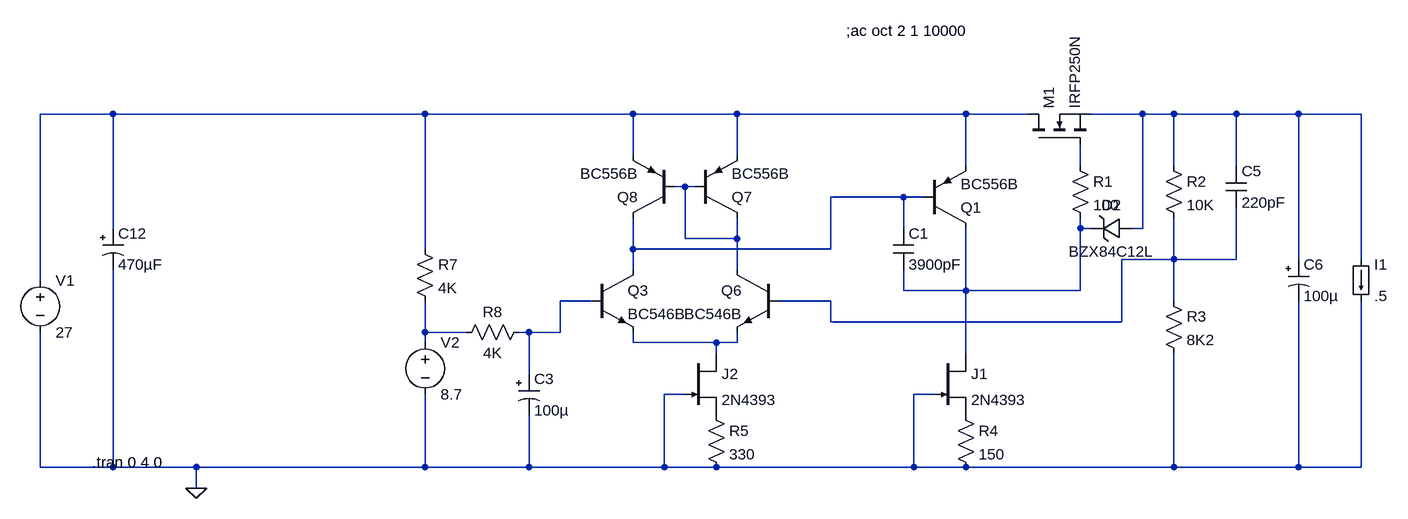
[diagram p0: schematic Sigma11-1.asc]
Sigma11-1.asc, the LTspice schematic file:
Version 4
SHEET 1 1752 1332
WIRE -272 112 -384 112
WIRE 208 112 -272 112
WIRE 528 112 208 112
WIRE 688 112 528 112
WIRE 1040 112 688 112
WIRE 1136 112 1040 112
WIRE 1312 112 1232 112
WIRE 1360 112 1312 112
WIRE 1456 112 1360 112
WIRE 1552 112 1456 112
WIRE 1648 112 1552 112
WIRE 528 176 528 112
WIRE 688 176 688 112
WIRE 1040 192 1040 112
WIRE 1216 192 1216 160
WIRE 1360 192 1360 112
WIRE 1456 192 1456 112
WIRE 608 224 592 224
WIRE 624 224 608 224
WIRE 944 240 832 240
WIRE 976 240 944 240
WIRE -272 288 -272 112
WIRE 944 288 944 240
WIRE 1216 288 1216 272
WIRE 1232 288 1216 288
WIRE 1312 288 1312 112
WIRE 1312 288 1296 288
WIRE 608 304 608 224
WIRE 688 304 688 272
WIRE 688 304 608 304
WIRE 208 320 208 112
WIRE 528 320 528 272
WIRE 832 320 832 240
WIRE 832 320 528 320
WIRE 1360 336 1360 272
WIRE 1360 336 1280 336
WIRE 1456 336 1456 256
WIRE 1456 336 1360 336
WIRE 1552 336 1552 112
WIRE 1648 336 1648 112
WIRE 528 352 528 320
WIRE 688 352 688 304
WIRE -384 368 -384 112
WIRE 944 384 944 352
WIRE 1040 384 1040 288
WIRE 1040 384 944 384
WIRE 1216 384 1216 288
WIRE 1216 384 1040 384
WIRE 464 400 416 400
WIRE 832 400 752 400
WIRE 1360 400 1360 336
WIRE 832 432 832 400
WIRE 1280 432 1280 336
WIRE 1280 432 832 432
WIRE 208 448 208 400
WIRE 272 448 208 448
WIRE 368 448 352 448
WIRE 416 448 416 400
WIRE 416 448 368 448
WIRE 208 464 208 448
WIRE 528 464 528 448
WIRE 656 464 528 464
WIRE 688 464 688 448
WIRE 688 464 656 464
WIRE 656 480 656 464
WIRE 1040 480 1040 384
WIRE 368 512 368 448
WIRE 608 544 576 544
WIRE 992 544 960 544
WIRE -384 656 -384 448
WIRE -272 656 -272 352
WIRE -272 656 -384 656
WIRE -144 656 -272 656
WIRE 208 656 208 544
WIRE 208 656 -144 656
WIRE 368 656 368 576
WIRE 368 656 208 656
WIRE 576 656 576 544
WIRE 576 656 368 656
WIRE 656 656 576 656
WIRE 960 656 960 544
WIRE 960 656 656 656
WIRE 1040 656 960 656
WIRE 1360 656 1360 480
WIRE 1360 656 1040 656
WIRE 1552 656 1552 400
WIRE 1552 656 1360 656
WIRE 1648 656 1648 400
WIRE 1648 656 1552 656
WIRE -144 688 -144 656
FLAG -144 688 0
SYMBOL nmos 1136 160 R270
SYMATTR InstName M1
SYMATTR Value IRFP250N
SYMBOL res 1200 176 R0
SYMATTR InstName R1
SYMATTR Value 100
SYMBOL res 1344 176 R0
SYMATTR InstName R2
SYMATTR Value 10K
SYMATTR SpiceLine tol=5
SYMBOL res 1344 384 R0
SYMATTR InstName R3
SYMATTR Value 8K2
SYMBOL pnp 976 288 M180
SYMATTR InstName Q1
SYMATTR Value BC556B
SYMBOL res 192 304 R0
SYMATTR InstName R7
SYMATTR Value 4K
SYMBOL res 368 432 R90
WINDOW 0 0 56 VBottom 2
WINDOW 3 32 56 VTop 2
SYMATTR InstName R8
SYMATTR Value 4K
SYMBOL polcap 352 512 R0
WINDOW 3 24 56 Left 2
SYMATTR Value 100µ
SYMATTR InstName C3
SYMATTR Description Capacitor
SYMATTR Type cap
SYMATTR SpiceLine V=6.3 Irms=2.9 Rser=0.018 Lser=0 mfg="KEMET" pn="A700D107M006ATE018" type="Al electrolytic"
SYMBOL npn 464 352 R0
SYMATTR InstName Q3
SYMATTR Value BC546B
SYMBOL npn 752 352 M0
SYMATTR InstName Q6
SYMATTR Value BC546B
SYMBOL pnp 624 272 M180
SYMATTR InstName Q7
SYMATTR Value BC556B
SYMBOL pnp 592 272 R180
SYMATTR InstName Q8
SYMATTR Value BC556B
SYMBOL cap 928 288 R0
SYMATTR InstName C1
SYMATTR Value 3900pF
SYMATTR SpiceLine V=100 Irms=4.58 Rser=0.025 Lser=0
SYMBOL cap 1440 192 R0
SYMATTR InstName C5
SYMATTR Value 220pF
SYMATTR SpiceLine V=100 Irms=4.58 Rser=0.025 Lser=0
SYMBOL polcap 1536 336 R0
WINDOW 3 24 56 Left 2
SYMATTR Value 100µ
SYMATTR InstName C6
SYMATTR Description Capacitor
SYMATTR Type cap
SYMATTR SpiceLine V=6.3 Irms=2.9 Rser=0.018 Lser=0 mfg="KEMET" pn="A700D107M006ATE018" type="Al electrolytic"
SYMBOL polcap -288 288 R0
WINDOW 3 24 56 Left 2
SYMATTR Value 470µF
SYMATTR InstName C12
SYMATTR Description Capacitor
SYMATTR Type cap
SYMATTR SpiceLine V=10 Irms=2.07 Rser=0.028 Lser=0
SYMBOL voltage -384 352 R0
WINDOW 123 0 0 Left 2
WINDOW 39 24 118 Left 2
SYMATTR InstName V1
SYMATTR Value 27
SYMBOL zener 1296 272 R90
WINDOW 0 -4 32 VBottom 2
WINDOW 3 36 32 VTop 2
SYMATTR InstName D2
SYMATTR Value BZX84C12L
SYMBOL load 1632 336 R0
WINDOW 123 0 0 Left 2
WINDOW 39 0 0 Left 2
SYMATTR InstName I1
SYMATTR Value .5
SYMBOL njf 992 480 R0
SYMATTR InstName J1
SYMATTR Value 2N4393
SYMBOL res 1024 560 R0
SYMATTR InstName R4
SYMATTR Value 150
SYMBOL njf 608 480 R0
SYMATTR InstName J2
SYMATTR Value 2N4393
SYMBOL res 640 560 R0
SYMATTR InstName R5
SYMATTR Value 330
SYMBOL voltage 208 448 R0
WINDOW 123 0 0 Left 2
WINDOW 39 0 0 Left 2
SYMATTR InstName V2
SYMATTR Value 8.7
TEXT -304 648 Left 2 !.tran 0 4 0
TEXT 856 -16 Left 2 !;ac oct 2 1 10000

The netlist it stands for:
* Sigma11-1.asc
M1 N001 N003 N002 N002 IRFP250N
R1 N003 N006 100
R2 N002 N007 10K tol=5
R3 N007 0 8K2
Q1 N006 N005 N001 0 BC556B
R7 N001 N009 4K
R8 N008 N009 4K
C3 N008 0 100µ V=6.3 Irms=2.9 Rser=0.018 Lser=0 mfg="KEMET" pn="A700D107M006ATE018" type="Al electrolytic"
Q3 N005 N008 N010 0 BC546B
Q6 N004 N007 N010 0 BC546B
Q7 N004 N004 N001 0 BC556B
Q8 N005 N004 N001 0 BC556B
C1 N005 N006 3900pF V=100 Irms=4.58 Rser=0.025 Lser=0
C5 N002 N007 220pF V=100 Irms=4.58 Rser=0.025 Lser=0
C6 N002 0 100µ V=6.3 Irms=2.9 Rser=0.018 Lser=0 mfg="KEMET" pn="A700D107M006ATE018" type="Al electrolytic"
C12 N001 0 470µF V=10 Irms=2.07 Rser=0.028 Lser=0
V1 N001 0 27
D2 N002 N006 BZX84C12L
I1 N002 0 .5
J1 N006 0 P001 2N4393
R4 P001 0 150
J2 N010 0 P002 2N4393
R5 P002 0 330
V2 N009 0 8.7
.model D D
.lib standard.dio
.model NPN NPN
.model PNP PNP
.lib standard.bjt
.model NJF NJF
.model PJF PJF
.lib standard.jft
.model NMOS NMOS
.model PMOS PMOS
.lib standard.mos
.tran 0 4 0
;ac oct 2 1 10000
.backanno
.end